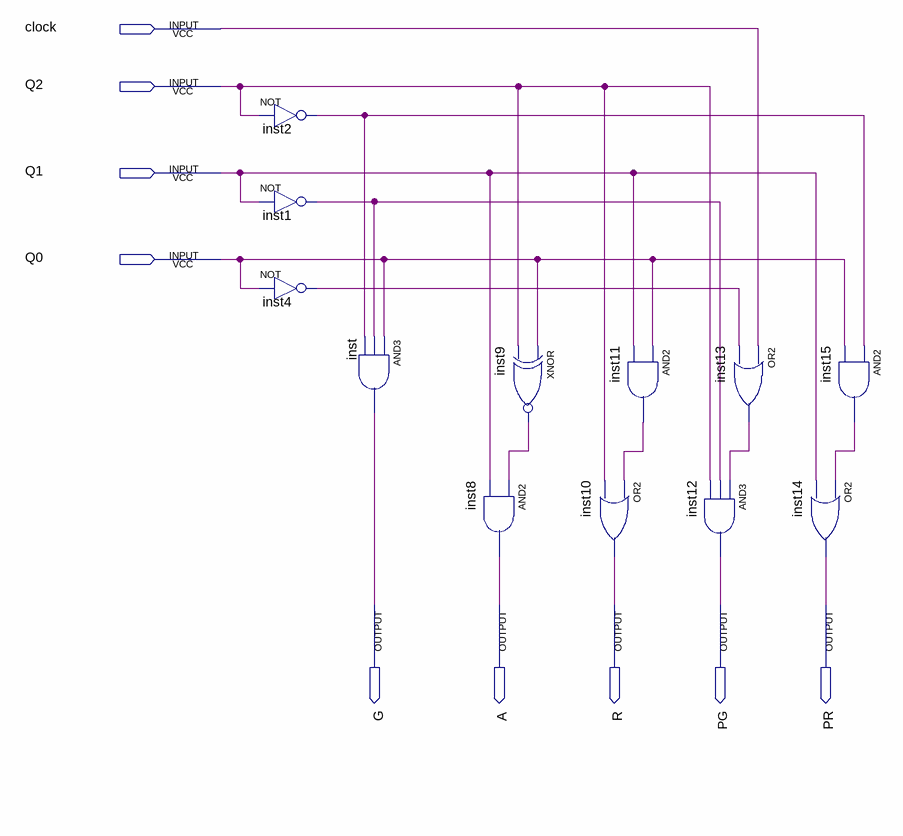
[diagram p0: schematic sheet]
// Quartus schematic traffic_light_decoder.bdf as structural Verilog: 12 symbols, 9 pins
module traffic_light_decoder (
  input  clock,
  input  Q2,
  input  Q1,
  input  Q0,
  output G,
  output A,
  output R,
  output PG,
  output PR
);

  wire inst1_out, inst2_out, inst4_out, inst9_out, inst11_out, inst13_out, inst15_out;

  not inst2 (inst2_out, Q2);
  not inst1 (inst1_out, Q1);
  not inst4 (inst4_out, Q0);
  and inst (G, Q0, inst1_out, inst2_out);
  and inst8 (A, inst9_out, Q1);
  xnor inst9 (inst9_out, Q0, Q2);
  and inst11 (inst11_out, Q0, Q1);
  or inst10 (R, inst11_out, Q2);
  and inst12 (PG, inst13_out, inst1_out, Q2);
  or inst13 (inst13_out, clock, inst4_out);
  and inst15 (inst15_out, inst2_out, Q0);
  or inst14 (PR, inst15_out, Q1);
endmodule
